# Altium schematic sheet blackfin_d_codec.SchDoc: Audio CODEC
size A3; SheetNumber: 4; SheetTotal: 6
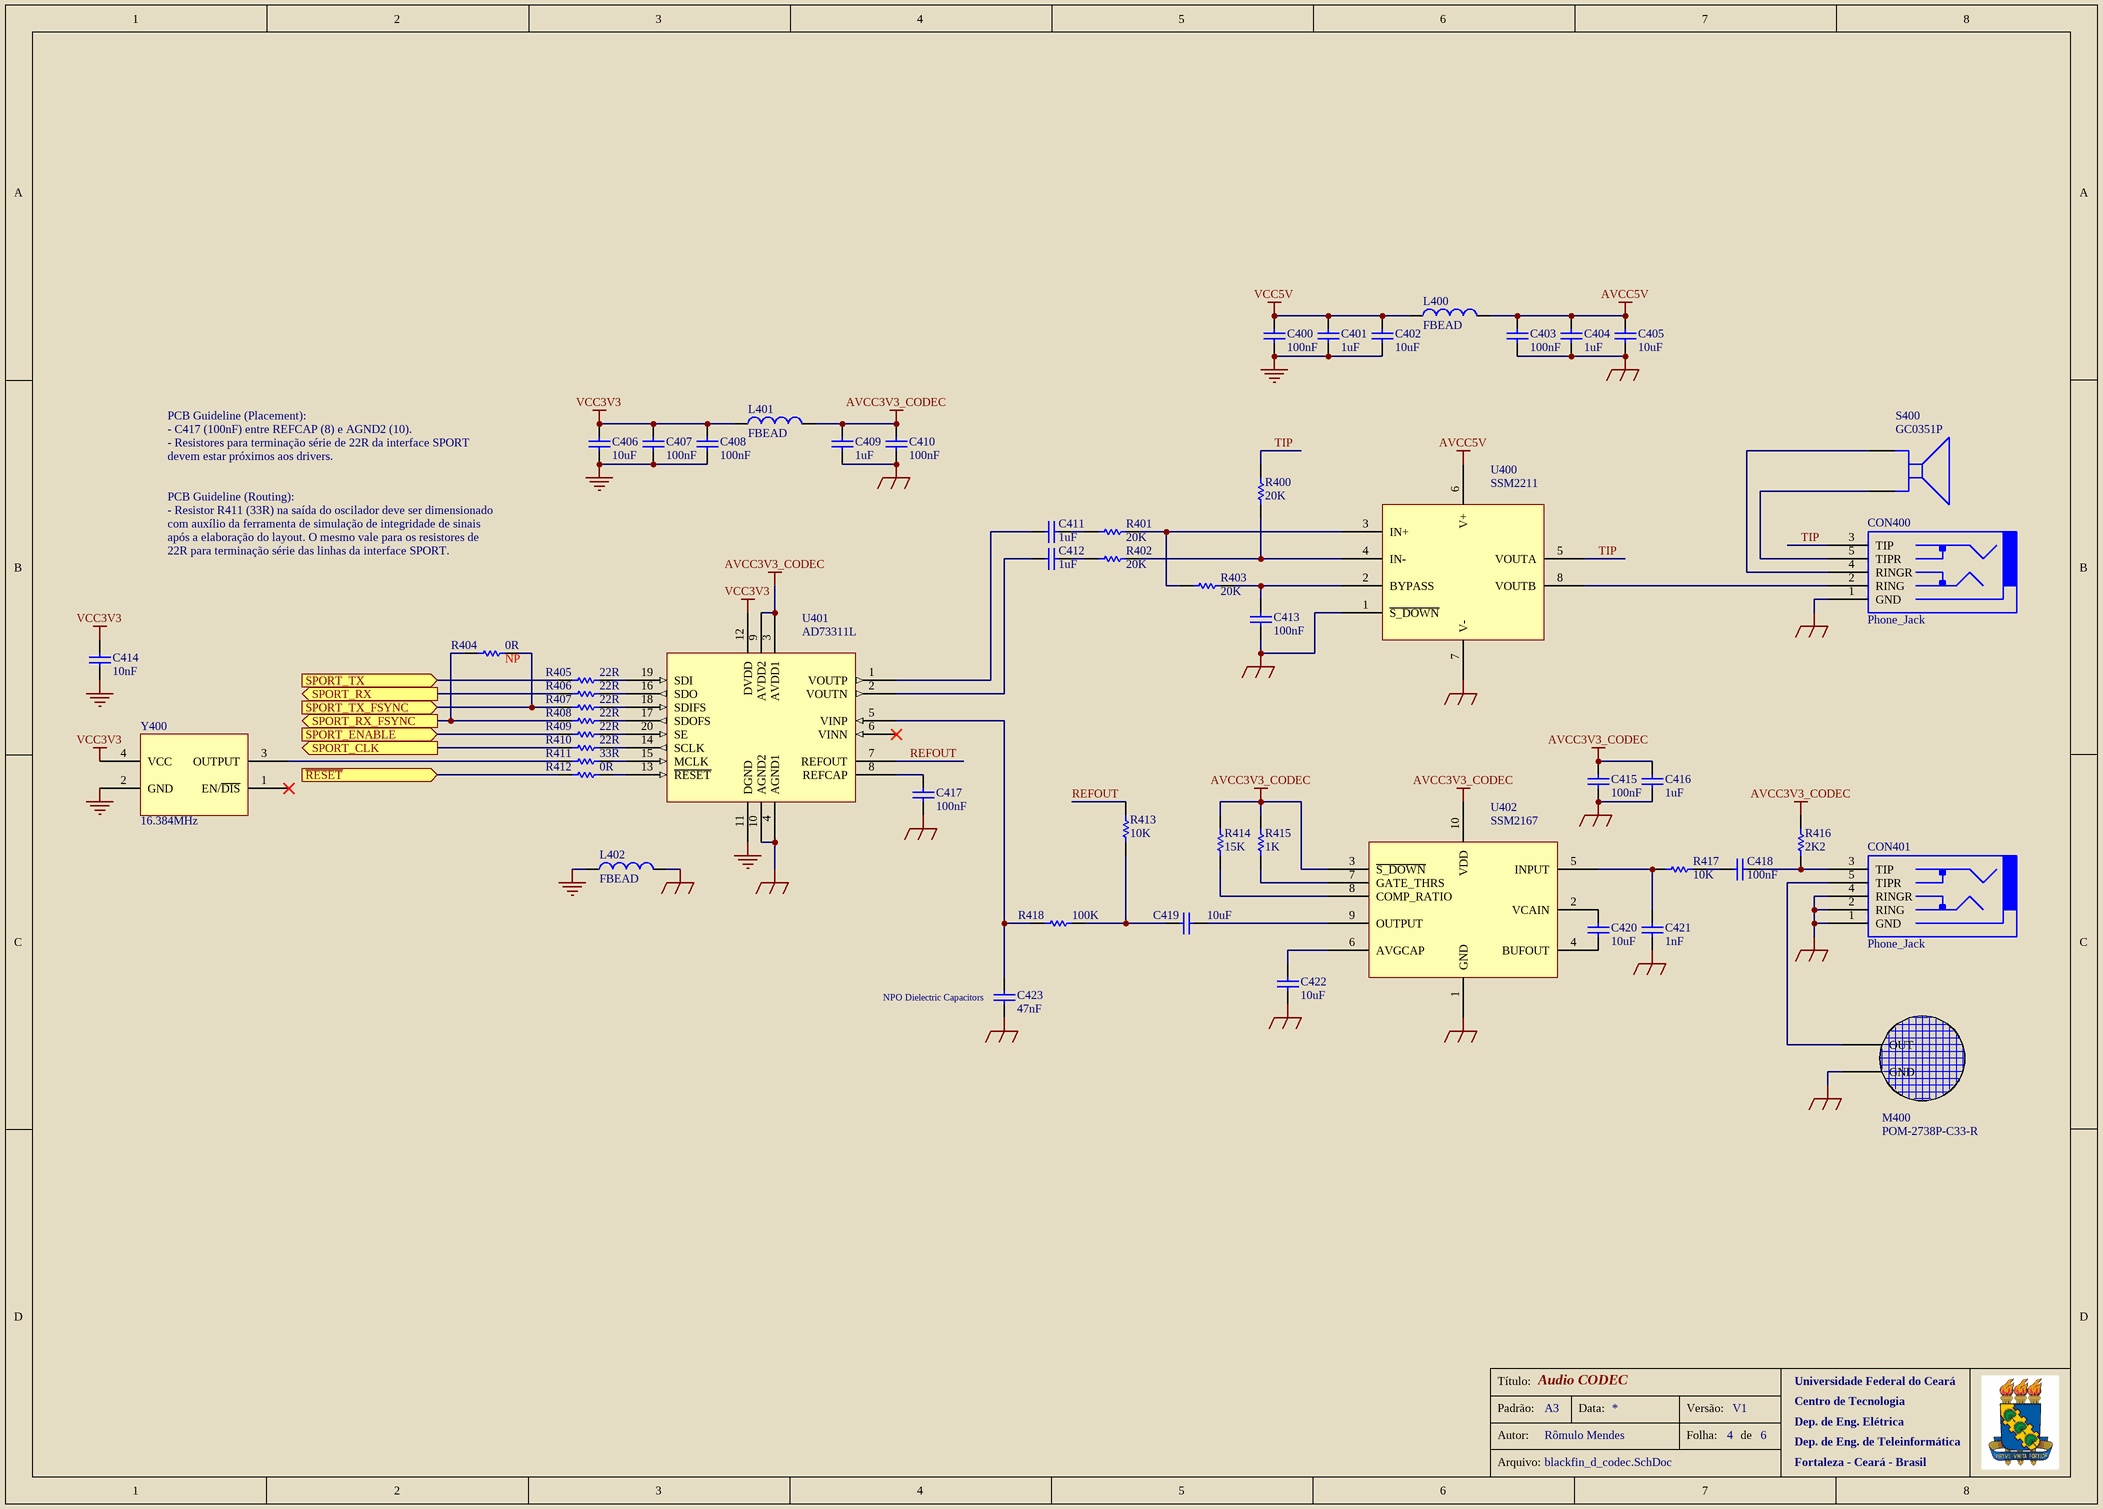
[diagram p0: blackfin_d_codec.SchDoc]

## Parts
C400  100nF  [C_0603]
C401  1uF  [C_0603]
C402  10uF  [C_0805]
C403  100nF  [C_0603]
C404  1uF  [C_0603]
C405  10uF  [C_0805]
C406  10uF  [C_0805]
C407  100nF  [C_0603]
C408  100nF  [C_0603]
C409  1uF  [C_0603]
C410  100nF  [C_0603]
C411  1uF  [C_0603]
C412  1uF  [C_0603]
C413  100nF  [C_0603]
C414  10nF  [C_0603]
C415  100nF  [C_0603]
C416  1uF  [C_0603]
C417  100nF  [C_0603]
C418  100nF  [C_0603]
C419  10uF  [C_0805]
C420  10uF  [C_0805]
C421  1nF  [C_0603]
C422  10uF  [C_0805]
C423  47nF  [C_0603]
CON400  Phone_Jack  [Phone_Jack]
CON401  Phone_Jack  [Phone_Jack]
L400  FBEAD  [L_0603]
L401  FBEAD  [L_0603]
L402  FBEAD  [L_0603]
M400  POM-2738P-C33-R  [Microphone]
R400  20K  [R_0603]
R401  20K  [R_0603]
R402  20K  [R_0603]
R403  20K  [R_0603]
R404  0R  [R_0603]
R405  22R  [R_0402]
R406  22R  [R_0402]
R407  22R  [R_0402]
R408  22R  [R_0402]
R409  22R  [R_0402]
R410  22R  [R_0402]
R411  33R  [R_0402]
R412  0R  [R_0603]
R413  10K  [R_0603]
R414  15K  [R_0603]
R415  1K  [R_0603]
R416  2K2  [R_0603]
R417  10K  [R_0603]
R418  100K  [R_0603]
S400  GC0351P  [Speaker]
U400  SSM2211  [SOIC-8 (SSM2211)]
U401  AD73311L  [TSSOP-20]
U402  SSM2167  [MSOP-10]
Y400  16.384MHz  [OSC_16.384MHz]

## Ports
SPORT_CLK (out), SPORT_ENABLE (in), SPORT_RX (out), SPORT_RX_FSYNC (out), SPORT_TX (in), SPORT_TX_FSYNC (in), ~{RESET} (in)

## Nets
AVCC3V3_CODEC: C409.2 C410.2 C415.2 C416.2 L401.2 R414.2 R415.2 R416.1 U401.3(AVDD1) U401.9(AVDD2) U402.3(~{S_DOWN}) U402.10(VDD)
AVCC5V: C403.2 C404.2 C405.2 L400.2 U400.6(V+)
EARTH: C403.1 C404.1 C405.1 C409.1 C410.1 C413.1 C415.1 C416.1 C417.1 C421.1 C422.2 C423.1 CON400.1(GND) CON401.1(GND) CON401.2(RING) CON401.4(RINGR) L402.2 M400.2(GND) U400.1(~{S_DOWN}) U400.7(V-) U401.4(AGND1) U401.10(AGND2) U402.1(GND)
GND: C400.1 C401.1 C402.1 C406.1 C407.1 C408.1 C414.1 L402.1 U401.11(DGND) Y400.2(GND)
VCC3V3: C406.2 C407.2 C408.2 C414.2 L401.1 U401.12(DVDD) Y400.4(VCC)
VCC5V: C400.2 C401.2 C402.2 L400.1
~{RESET}: R412.1 ; port ~{RESET}
REFOUT: R413.2 U401.7(REFOUT)
SPORT_CLK: R410.1 ; port SPORT_CLK
SPORT_ENABLE: R409.1 ; port SPORT_ENABLE
SPORT_RX: R406.1 ; port SPORT_RX
SPORT_RX_FSYNC: R404.1 R408.1 ; port SPORT_RX_FSYNC
SPORT_TX: R405.1 ; port SPORT_TX
SPORT_TX_FSYNC: R404.2 R407.1 ; port SPORT_TX_FSYNC
TIP: CON400.3(TIP) R400.2 U400.5(VOUTA)
NetC411_1: C411.1 R401.2
NetC411_2: C411.2 U401.1(VOUTP)
NetC412_1: C412.1 R402.2
NetC412_2: C412.2 U401.2(VOUTN)
NetC413_2: C413.2 R403.1 U400.2(BYPASS)
NetC417_2: C417.2 U401.8(REFCAP)
NetC418_1: C418.1 CON401.3(TIP) R416.2
NetC418_2: C418.2 R417.1
NetC419_1: C419.1 U402.9(OUTPUT)
NetC419_2: C419.2 R413.1 R418.1
NetC420_1: C420.1 U402.4(BUFOUT)
NetC420_2: C420.2 U402.2(VCAIN)
NetC421_2: C421.2 R417.2 U402.5(INPUT)
NetC422_1: C422.1 U402.6(AVGCAP)
NetC423_2: C423.2 R418.2 U401.5(VINP)
NetCON400_2: CON400.2(RING) U400.8(VOUTB)
NetCON400_4: CON400.4(RINGR) S400.1(CKT1)
NetCON400_5: CON400.5(TIPR) S400.2(CKT2)
NetCON401_5: CON401.5(TIPR) M400.1(OUT)
NetR400_1: R400.1 R402.1 U400.4(IN-)
NetR401_1: R401.1 R403.2 U400.3(IN+)
NetR405_2: R405.2 U401.19(SDI)
NetR406_2: R406.2 U401.16(SDO)
NetR407_2: R407.2 U401.18(SDIFS)
NetR408_2: R408.2 U401.17(SDOFS)
NetR409_2: R409.2 U401.20(SE)
NetR410_2: R410.2 U401.14(SCLK)
NetR411_1: R411.1 Y400.3(OUTPUT)
NetR411_2: R411.2 U401.15(MCLK)
NetR412_2: R412.2 U401.13(~{RESET})
NetR414_1: R414.1 U402.8(COMP_RATIO)
NetR415_1: R415.1 U402.7(GATE_THRS)

Not connected (* = marked no-connect by the designer): U401 6(VINN)*; Y400 1(EN/~{DIS})*

## Notes on the sheet
- PCB Guideline (Placement):
- - C417 (100nF) entre REFCAP (8) e AGND2 (10).
- - Resistores para terminação série de 22R da interface SPORT
- devem estar próximos aos drivers.
- PCB Guideline (Routing):
- - Resistor R411 (33R) na saída do oscilador deve ser dimensionado
- com auxílio da ferramenta de simulação de integridade de sinais
- após a elaboração do layout. O mesmo vale para os resistores de
- 22R para terminação série das linhas da interface SPORT.
- (near R404) NP
- (near C423) NPO Dielectric Capacitors
- Título:
- Universidade Federal do Ceará
- Padrão:
- Autor:
- A3
- Rômulo Mendes
- Data:
- Versão:
- Folha:
- V1
- de
- Centro de Tecnologia
- Dep. de Eng. Elétrica
- Dep. de Eng. de Teleinformática
- Arquivo:
- Fortaleza - Ceará - Brasil

## Library data of the parts
C400 C403 C407 C408 C410 C413 C415 C417 C418 = Capacitor: eVendorPart#: 81-GRM188R71E104KA01; Manufacturer: Murata; Part#: GRM188R71E104KA01J; eVendor: Mouser; eVendorPrice: 0,14; MSRP: 0,11; MOQ: 1000
C401 C404 C409 C411 C412 C416 = Capacitor: eVendorPart#: 81-GRM188F51E105ZA12; Manufacturer: Murata; Part#: GRM188F51E105ZA12D; eVendor: Mouser; eVendorPrice: 0,07; MSRP: 0,016; MOQ: 1000
C402 C405 C406 C419 C420 C422 = Capacitor: eVendorPart#: 810-C2012Y5V1C106Z; Manufacturer: TDK; Part#: C2012Y5V1C106Z; eVendor: Mouser; eVendorPrice: 0,10; MSRP: 0,05; MOQ: 1000
C414 = Capacitor: eVendorPart#: 77-VJ0603Y103KXAPBC; Manufacturer: Vishay/Vitramon; Part#: VJ0603Y103KXAPW1BC; eVendor: Mouser; eVendorPrice: 0,05; MSRP: 0,013; MOQ: 1000
C421 = Capacitor: eVendorPart#: 81-GRM1885C2A102JA01; Manufacturer: Murata; Part#: GRM1885C2A102JA01D; eVendor: Mouser; eVendorPrice: 0,08; MSRP: 0,019; MOQ: 1000
C423 = Capacitor: eVendorPart#: 81-GRM188R71H473KA61; Manufacturer: Murata; Part#: GRM188R71H473KA61D; eVendor: Mouser; eVendorPrice: 0,07; MSRP: 0,012; MOQ: 1000
CON400 CON401 = Phone_Jack: eVendorPart#: CP1-2535SJCT-ND; Manufacturer: CUI Inc; Part#: SJ1-2535-SMT; eVendorPrice: 0,75; eVendor: Digikey; MSRP: 0,415; MOQ: 1000
L400-L402 = Inductor: eVendorPart#: 875-MI0603L301R-10; Manufacturer: Laird Technologies; Part#: MI0603L301R-10; eVendor: Mouser; eVendorPrice: 0,16; MSRP: 0,066; MOQ: 1000
M400 = Microphone: eVendorPart#: 665-POM2738PC33R; Manufacturer: PUI Audio; MSRP: 1,13; eVendorPrice: 1,98; eVendor: Mouser; Part#: POM-2738P-C33-R; MOQ: 1000
R400-R403 = Resistor: eVendorPart#: 71-CRCW0603J-20K-E3; Part#: CRCW060320K0JNEA; Manufacturer: Vishay/Dale; eVendor: Mouser; eVendorPrice: 0,06; MSRP: 0,01; MOQ: 1000
R404 R412 = Resistor: eVendorPart#: 71-CRCW06030000Z0EB; Part#: CRCW06030000Z0EB; Manufacturer: Vishay/Dale; eVendor: Mouser; eVendorPrice: 0,06; MSRP: 0,015; MOQ: 1000
R405-R410 = Resistor: eVendorPart#: 71-CRCW0402J-22-E3; Part#: CRCW040222R0JNED; Manufacturer: Vishay/Dale; eVendor: Mouser; eVendorPrice: 0,06; MSRP: 0,01; MOQ: 1000
R411 = Resistor: eVendorPart#: 71-CRCW0402J-33-E3; Part#: CRCW040233R0JNED; Manufacturer: Vishay/Dale; eVendor: Mouser; eVendorPrice: 0,06; MSRP: 0,01; MOQ: 1000
R413 R417 = Resistor: eVendorPart#: 71-CRCW0603-10K-E3; Part#: CRCW060310K0FKEA; Manufacturer: Vishay/Dale; eVendor: Mouser; eVendorPrice: 0,06; MSRP: 0,015; MOQ: 1000
R414 = Resistor: eVendorPart#: 71-CRCW0603J-15K-E3; Part#: CRCW060315K0JNEA; Manufacturer: Vishay/Dale; eVendor: Mouser; eVendorPrice: 0,06; MSRP: 0,01; MOQ: 1000
R415 = Resistor: eVendorPart#: 71-CRCW06031K00JNEB; Part#: CRCW06031K00JNEB; Manufacturer: Vishay/Dale; eVendor: Mouser; eVendorPrice: 0,06; MSRP: 0,01; MOQ: 1000
R416 = Resistor: eVendorPart#: 71-CRCW06032K20JNEB; Part#: CRCW06032K20JNEB; Manufacturer: Vishay/Dale; eVendor: Mouser; eVendorPrice: 0,06; MSRP: 0,01; MOQ: 1000
R418 = Resistor: eVendorPart#: 71-CRCW0603J-100K-E3; Part#: CRCW0603100KJNEA; Manufacturer: Vishay/Dale; eVendor: Mouser; eVendorPrice: 0,06; MSRP: 0,01; MOQ: 1000
S400 = Speaker: eVendorPart#: GC0351P-3-ND; Part#: GC0351P-3; Manufacturer: CUI Inc; eVendor: Digikey; eVendorPrice: 4,98; MSRP: 2,65267; MOQ: 1000
U400 = SSM2211: eVendorPart#: SSM2211SZ-ND; Part#: SSM2211SZ; Manufacturer: Analog Devices; eVendor: Digikey; eVendorPrice: 1,23; MSRP: 0,574; MOQ: 1000
U401 = AD73311L: eVendorPart#: AD73311LARUZ; Manufacturer: Analog Devices; eVendor: Avnet; MSRP: 3,41; eVendorPrice: 3,60; Part#: AD73311LARUZ; MOQ: 1000
U402 = SSM2167: eVendorPart#: SSM2167-1RMZ-REELCT-ND; Manufacturer: Analog Devices; Part#: SSM2167-1RMZ-REEL; eVendor: Digikey; eVendorPrice: 2,34; MSRP: 1,352; MOQ: 1000
Y400 = Oscillator_16.384MHz: eVendorPart#: 695-CSX750FBC-163; Part#: CSX750FBC-16.384M-UT; Manufacturer: Citizen; eVendor: Mouser; eVendorPrice: 2,98; MSRP: 1,20; MOQ: 1000